# Altium schematic sheet interface.SchDoc
size A3
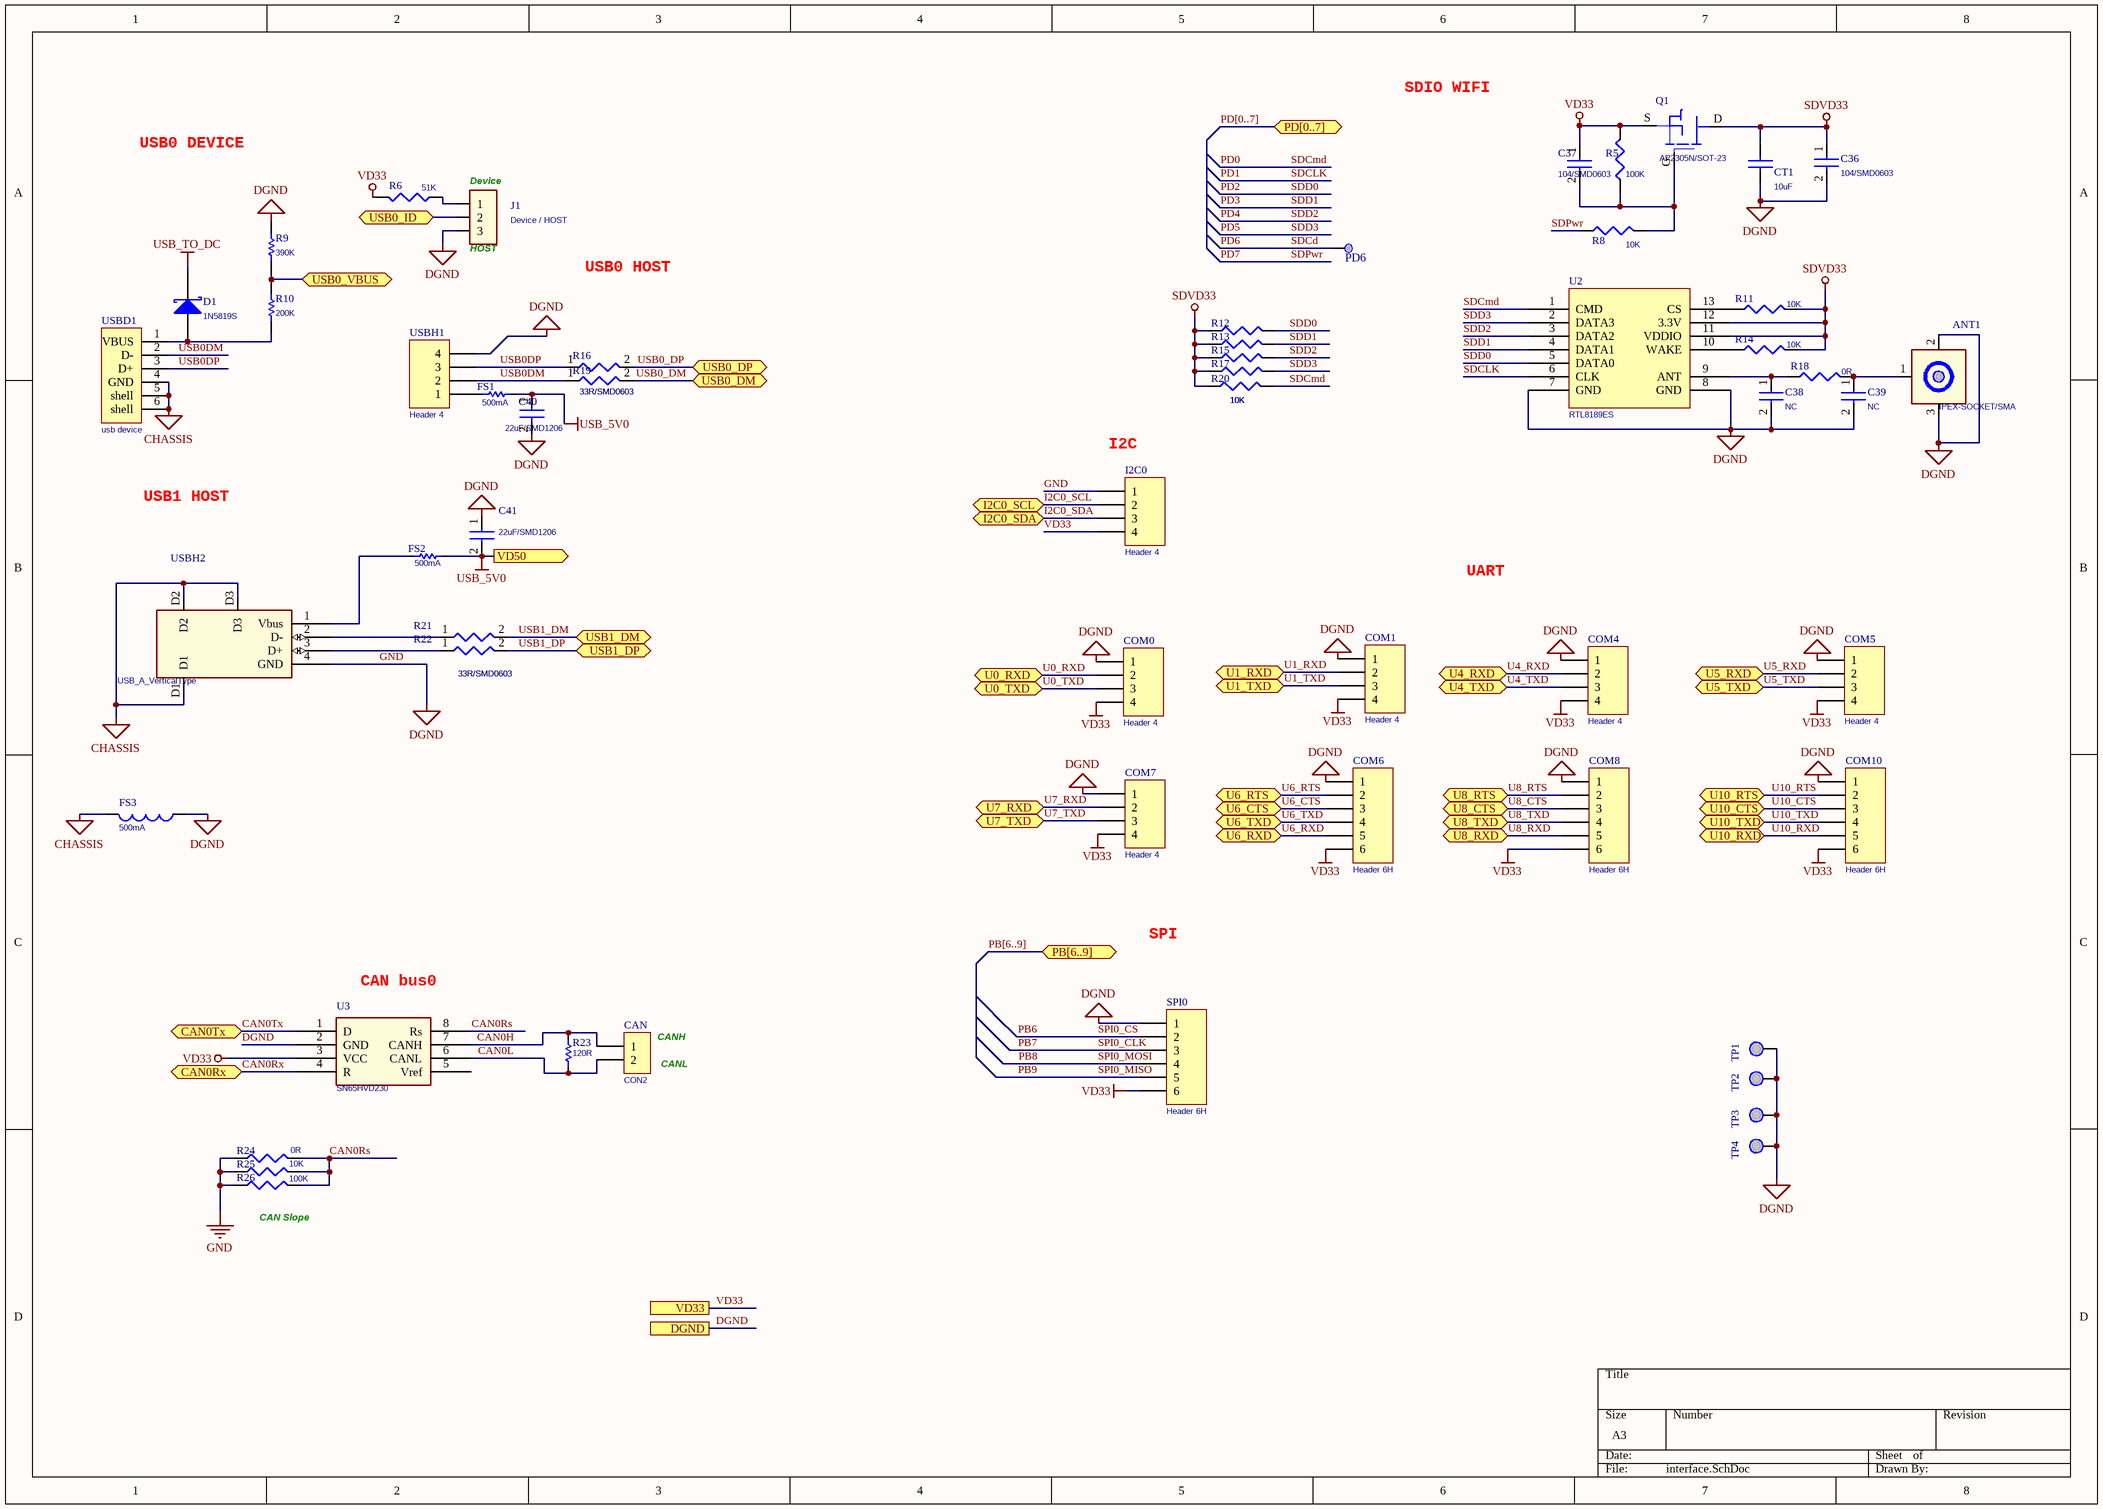
[diagram p0: interface.SchDoc]

## Parts
ANT1  IPEX-SOCKET/SMA  [ANT_PIX]
C36  104/SMD0603  [0603C]
C37  104/SMD0603  [0603C]
C38  NC  [0603C]
C39  NC  [0603C]
C40  22uF/SMD1206  [C0805]
C41  22uF/SMD1206  [C0805]
CAN  CON2  [INTERFACE-2]
COM0  Header 4  [PH04S_180]
COM1  Header 4  [PH04S_180]
COM4  Header 4  [PH04S_180]
COM5  Header 4  [PH04S_180]
COM6  Header 6H  [PH06S]
COM7  Header 4  [PH04S_180]
COM8  Header 6H  [PH06S]
COM10  Header 6H  [PH06S]
CT1  10uF  [C0805]
D1  1N5819S  [SOD-123_1N5819HW]
FS1  500mA  [0805]
FS2  500mA  [0805]
FS3  500mA  [0805R]
I2C0  Header 4  [PH04S_180]
J1  Device / HOST  [SIP3]
PD6  TP  [TP]  (value not drawn)
Q1  AP2305N/SOT-23  [AP2305N_SOT23]
R5  100K  [0603R]
R6  51K  [0603R]
R8  10K  [0603R]
R9  390K  [0603R]
R10  200K  [0603R]
R11  10K  [0603R]
R12  10K  [0603R]
R13  10K  [0603R]
R14  10K  [0603R]
R15  10K  [0603R]
R16  33R/SMD0603  [0603R]
R17  10K  [0603R]
R18  0R  [0603R]
R19  33R/SMD0603  [0603R]
R20  10K  [0603R]
R21  33R/SMD0603  [0603R]
R22  33R/SMD0603  [0603R]
R23  120R  [0805]
R24  0R  [0603R]
R25  10K  [0603R]
R26  100K  [0603R]
SPI0  Header 6H  [PH06S]
TP1  TEST POINT  [HOLE53]  (value not drawn)
TP2  TEST POINT  [HOLE53]  (value not drawn)
TP3  TEST POINT  [HOLE53]  (value not drawn)
TP4  TEST POINT  [HOLE53]  (value not drawn)
U2  RTL8189ES  [RTL8189ES]
U3  SN65HVD230  [SOIC127P800-8N]
USBD1  usb device  [USB-MICRO-AB]
USBH1  Header 4  [PH04S_180]
USBH2  USB_A_VerticalType  [USB/A 90]

## Ports
CAN0Rx, CAN0Tx, DGND, I2C0_SCL, I2C0_SDA, PB[6..9], PD[0..7], U0_RXD, U0_TXD, U1_RXD, U1_TXD, U4_RXD, U4_TXD, U5_RXD, U5_TXD, U6_CTS, U6_RTS, U6_RXD, U6_TXD, U7_RXD, U7_TXD, U8_CTS, U8_RTS, U8_RXD, U8_TXD, U10_CTS, U10_RTS, U10_RXD, U10_TXD, USB0_DM, USB0_DP, USB0_ID, USB0_VBUS, USB1_DM, USB1_DP, VD33, VD50 (out)

## Nets
CHASSIS: FS3.2 USBD1.4(GND) USBD1.5(shell) USBD1.6(shell) USBH2.D1 USBH2.D2 USBH2.D3
DGND: ANT1.2 ANT1.3 C36.2 C38.2 C39.2 C40.2 C41.1 COM0.1 COM1.1 COM4.1 COM5.1 COM6.1 COM7.1 COM8.1 COM10.1 CT1.1 FS3.1 I2C0.1 J1.3 R9.1 R24.1 R25.1 R26.1 SPI0.1 TP1.1(TP) TP2.1(TP) TP3.1(TP) TP4.1(TP) U2.7(GND) U2.8(GND) U3.2(GND) USBH1.4 USBH2.4(GND) ; port DGND  [also labelled GND]
SDVD33: C36.1 CT1.2 Q1.D R11.1 R12.2 R13.2 R14.1 R15.2 R17.2 R20.2 U2.11(VDDIO) U2.12(3.3V)
USB_5V0: C40.1 C41.2 FS1.1 FS2.1 ; port VD50
USB_TO_DC: D1.1(K)
VD33: C37.1 COM0.4 COM1.4 COM4.4 COM5.4 COM6.6 COM7.4 COM8.6 COM10.6 I2C0.4 Q1.S R5.2 R6.2 SPI0.6 U3.3(VCC) ; port VD33
CAN0H: CAN.2(1) R23.2 U3.7(CANH)
CAN0L: CAN.1(2) R23.1 U3.6(CANL)
CAN0Rs: R24.2 R25.2 R26.2 U3.8(Rs)
CAN0Rx: U3.4(R) ; port CAN0Rx
CAN0Tx: U3.1(D) ; port CAN0Tx
I2C0_SCL: I2C0.2 ; port I2C0_SCL
I2C0_SDA: I2C0.3 ; port I2C0_SDA
PB6: SPI0.2  [also labelled SPI0_CS]
PB7: SPI0.3  [also labelled SPI0_CLK]
PB8: SPI0.4  [also labelled SPI0_MOSI]
PB9: SPI0.5  [also labelled SPI0_MISO]
PD0: R20.1 U2.1(CMD)  [also labelled SDCmd]
PD1: U2.6(CLK)  [also labelled SDCLK]
PD2: R12.1 U2.5(DATA0)  [also labelled SDD0]
PD3: R13.1 U2.4(DATA1)  [also labelled SDD1]
PD4: R15.1 U2.3(DATA2)  [also labelled SDD2]
PD5: R17.1 U2.2(DATA3)  [also labelled SDD3]
PD6: PD6.1  [also labelled SDCd]
PD7: R8.2  [also labelled SDPwr]
U0_RXD: COM0.2 ; port U0_RXD
U0_TXD: COM0.3 ; port U0_TXD
U1_RXD: COM1.2 ; port U1_RXD
U1_TXD: COM1.3 ; port U1_TXD
U4_RXD: COM4.2 ; port U4_RXD
U4_TXD: COM4.3 ; port U4_TXD
U5_RXD: COM5.2 ; port U5_RXD
U5_TXD: COM5.3 ; port U5_TXD
U6_CTS: COM6.3 ; port U6_CTS
U6_RTS: COM6.2 ; port U6_RTS
U6_RXD: COM6.5 ; port U6_RXD
U6_TXD: COM6.4 ; port U6_TXD
U7_RXD: COM7.2 ; port U7_RXD
U7_TXD: COM7.3 ; port U7_TXD
U8_CTS: COM8.3 ; port U8_CTS
U8_RTS: COM8.2 ; port U8_RTS
U8_RXD: COM8.5 ; port U8_RXD
U8_TXD: COM8.4 ; port U8_TXD
U10_CTS: COM10.3 ; port U10_CTS
U10_RTS: COM10.2 ; port U10_RTS
U10_RXD: COM10.5 ; port U10_RXD
U10_TXD: COM10.4 ; port U10_TXD
USB0_DM: R19.2 ; port USB0_DM
USB0_DP: R16.2 ; port USB0_DP
USB0_ID: J1.2 ; port USB0_ID
USB0_VBUS: R9.2 R10.2 ; port USB0_VBUS
USB0DM: R19.1 USBD1.2(D-) USBH1.2
USB0DP: R16.1 USBD1.3(D+) USBH1.3
USB1_DM: R21.2 ; port USB1_DM
USB1_DP: R22.2 ; port USB1_DP
NetANT1_1: ANT1.1 C39.1 R18.1
NetC37_2: C37.2 Q1.G R5.1 R8.1
NetC38_1: C38.1 R18.2 U2.9(ANT)
NetD1_2: D1.2(A) R10.1 USBD1.1(VBUS)
NetFS1_2: FS1.2 USBH1.1
NetFS2_2: FS2.2 USBH2.1(Vbus)
NetJ1_1: J1.1 R6.1
NetR11_2: R11.2 U2.13(CS)
NetR14_2: R14.2 U2.10(WAKE)
NetR21_1: R21.1 USBH2.2(D-)
NetR22_1: R22.1 USBH2.3(D+)

Not connected (* = marked no-connect by the designer): U3 5(Vref)

## Buses and harness runs
bus PB[6..9] = port PB[6..9]
bus PD[0..7] = port PD[0..7]

## Notes on the sheet
- SDIO WIFI
- USB0 DEVICE
- (near J1) Device
- (near J1) HOST
- USB0 HOST
- (near I2C0) I2C
- USB1 HOST
- UART
- (near U3) CAN bus0
- SPI
- (near CAN) CANH
- (near CAN) CANL
- CAN Slope

## Library data of the parts
C36-C39 = C/SMD0603
C40 C41 = C/SMD1206
CAN = CON2: Connector
COM0 COM1 COM4 COM5 COM7 I2C0 USBH1 = Header 4: Header, 4-Pin; LatestRevisionDate: 17-Jul-2002; LatestRevisionNote: Re-released for DXP Platform.; Publisher: Altium Limited
COM6 COM8 COM10 SPI0 = Header 6H: Header, 6-Pin, Right Angle; LatestRevisionDate: 17-Jul-2002; LatestRevisionNote: Re-released for DXP Platform.; Publisher: Altium Limited
CT1 = CAP NP_Dup1
D1 = Diode 10TQ035: Schottky Rectifier; Note: Terminal 2 is the TAB and is electrically connected to the cathode; Published: 8-Jun-2000; LatestRevisionDate: 17-Jul-2002; LatestRevisionNote: Re-released for DXP Platform.; DatasheetVersion: PD-2.057B; PackageVersion: Feb-1998; PackageReference: TO-220AC; Publisher: Altium Limited; PackageDescription: TO, Thru-Hole, Vertical, Heatsink Mounted; 3 In-Line Leads (1 Absent); Pitch 2.54 mm; ComponentLink1Description: Manufacturer Link; ComponentLink1URL: http://www.irf.com/; ComponentLink2Description: Datasheet; ComponentLink2URL: http://www.irf.com/product-info/datasheets/data/10tq.pdf
FS1 FS2 R23 = Res1: Resistor; Published: *; Revision: *; Publisher: *; Value: *
FS3 = Inductor: Value: 100uH; Published: 8-Jun-2000; Revision: July-2002: Re-released for DXP Platform.; Publisher: Altium Limited
J1 = CON3
R5 R6 R8 R11-R15 R17 R18 R20 R24-R26 = R_Dup1
  R24-R26: Package: R0402
R9 R10 = res1: Resistor; Value: 1K; Published: 8-Jun-2000; Revision: July-2002: Re-released for DXP Platform.; Publisher: Altium Limited
R16 R19 R21 R22 = R/SMD0603_Dup1
TP1-TP4 = TEST POINT_Dup1
USBD1 = USB: USB接口
U3 = SN65HVD230: Package: SO-8